# Altium project ROBOT_PCB_PROJECT.PrjPcb
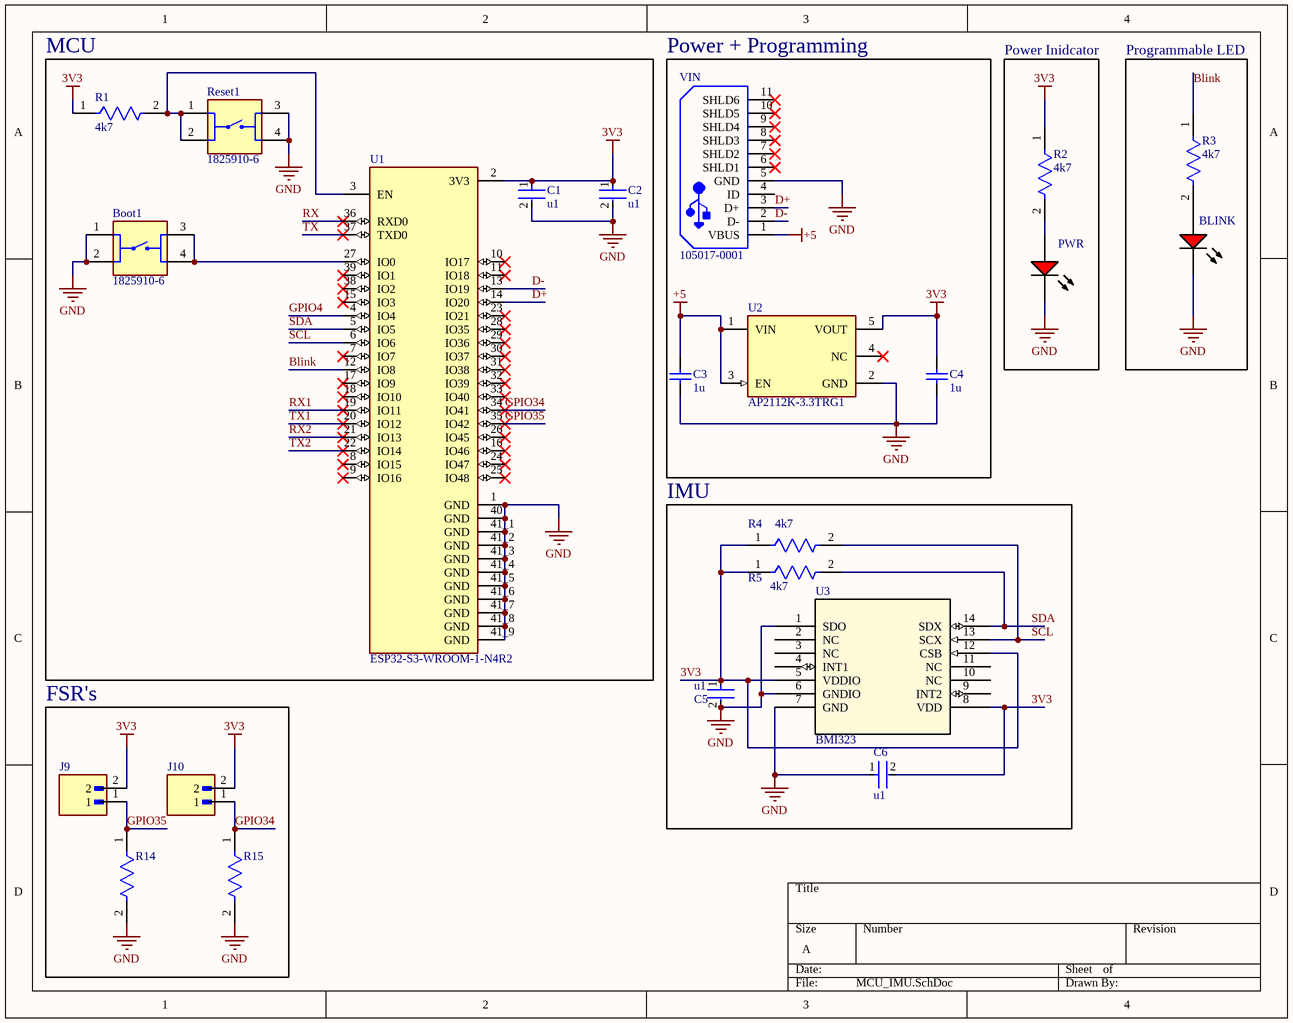
[diagram p0: MCU_IMU.SchDoc]
3 sheets, 101 parts. Net scope: global (net labels, ports and power ports of the same name join across sheets).
Board file: ROBOT_MOTHERBOARD.PcbDoc
Sheets:
  MCU_IMU.SchDoc
  UART_LOGIC.SchDoc
  Jetson_power.SchDoc

## Sheet MCU_IMU.SchDoc
size A; SheetNumber: 1; SheetTotal: 3

### Parts
BLINK  SML-LX1206IC-TR  [LUMX-SML-LX1206IC_V]  (value not drawn)
Boot1  1825910-6  [SW_1825910-6-4]
C1  u1  [FP-CC0805-0_85-MFG]
C2  u1  [FP-CC0805-0_85-MFG]
C3  1u  [CAPC2013X140X50ML20T25]
C4  1u  [CAPC2013X140X50ML20T25]
C5  u1  [FP-CC0805-0_85-MFG]
C6  u1  [FP-CC0805-0_85-MFG]
J9  M20-9990246  [HARWIN_M20-9990246]  (value not drawn)
J10  M20-9990246  [HARWIN_M20-9990246]  (value not drawn)
PWR  SML-LX1206IC-TR  [LUMX-SML-LX1206IC_V]  (value not drawn)
R1  4k7  [FP-CRCW0805-e3-IPC_B]
R2  4k7  [FP-CRCW0805-e3-IPC_B]
R3  4k7  [FP-CRCW0805-e3-IPC_B]
R4  4k7  [FP-CRCW0805-e3-IPC_B]
R5  4k7  [FP-CRCW0805-e3-IPC_B]
R14  RMCF1206FG10K0  [FP-RMCF1206-MFG]  (value not drawn)
R15  RMCF1206FG10K0  [FP-RMCF1206-MFG]  (value not drawn)
Reset1  1825910-6  [SW_1825910-6-4]
U1  ESP32-S3-WROOM-1-N4R2  [XCVR_ESP32-S3-WROOM-1-N4R2]
U2  AP2112K-3.3TRG1  [FP-SOT25-IPC_A]
U3  BMI323  [BMI323_BOS]
VIN  105017-0001  [USB-MICRO-B_V]

### Blocks framed on the sheet
MCU: Boot1 C1 C2 R1 Reset1 U1
Power + Programming: C3 C4 U2 VIN
Power Inidcator: PWR R2
Programmable LED: BLINK R3
IMU: C5 C6 R4 R5 U3
FSR's: J9 J10 R14 R15

### Nets
3V3: C1.1 C2.1 C4.2 C5.1 C6.2 J9.2 J10.2 R1.1 R2.1 R4.1 R5.1 U1.2(3V3) U2.5(VOUT) U3.5(VDDIO) U3.8(VDD) U3.12(CSB)
+5: C3.2 U2.1(VIN) U2.3(EN) VIN.1(VBUS)
GND: BLINK.2(K) Boot1.1 Boot1.2 C1.2 C2.2 C3.1 C4.1 C5.2 C6.1 PWR.2(K) R14.2 R15.2 Reset1.3 Reset1.4 U1.1(GND) U1.40(GND) U1.41_1(GND) U1.41_2(GND) U1.41_3(GND) U1.41_4(GND) U1.41_5(GND) U1.41_6(GND) U1.41_7(GND) U1.41_8(GND) U1.41_9(GND) U2.2(GND) U3.1(SDO) U3.6(GNDIO) U3.7(GND) VIN.5(GND)
Blink: R3.1 U1.12(IO8)
D+: U1.14(IO20) VIN.3(D+)
D-: U1.13(IO19) VIN.2(D-)
GPIO4: U1.4(IO4)
GPIO34: J10.1 R15.1 U1.34(IO41)
GPIO35: J9.1 R14.1 U1.35(IO42)
RX: U1.36(RXD0)
RX1: U1.19(IO11)
RX2: U1.21(IO13)
SCL: R4.2 U1.6(IO6) U3.13(SCX)
SDA: R5.2 U1.5(IO5) U3.14(SDX)
TX: U1.37(TXD0)
TX1: U1.20(IO12)
TX2: U1.22(IO14)
NetBLINK_1: BLINK.1(A) R3.2
NetBoot1_3: Boot1.3 Boot1.4 U1.27(IO0)
NetPWR_1: PWR.1(A) R2.2
NetR1_2: R1.2 Reset1.1 Reset1.2 U1.3(EN)

Not connected (* = marked no-connect by the designer): U1 7(IO7)* 8(IO15)* 9(IO16)* 10(IO17)* 11(IO18)* 15(IO3)* 16(IO46)* 17(IO9)* 18(IO10)* 23(IO21)* 24(IO47)* 25(IO48)* 26(IO45)* 28(IO35)* 29(IO36)* 30(IO37)* 31(IO38)* 32(IO39)* 33(IO40)* 38(IO2)* 39(IO1)*; U2 4(NC)*; U3 2(NC) 3(NC) 4(INT1) 9(INT2) 10(NC) 11(NC); VIN 4(ID) 6(SHLD1)* 7(SHLD2)* 8(SHLD3)* 9(SHLD4)* 10(SHLD5)* 11(SHLD6)*

### Library data of the parts
BLINK PWR = CMP-2000-07123-1: LED Red, 65 mW, -40 to 85 degC, 2-Pin SMD, RoHS, Tape and Reel; Manufacturer: Lumex; LED Material: GaAsP; Peak Wavelength: 635nm; Number of LEDs: 1; Viewing Angle: 160; Reverse Voltage: 5(Min)V; Lens Appearance: ColorlessNonDiffused; Intensity: 6mcd; Pin_Count: 2; Lens Dimensions: 2x1.6x0.5mm; Mounting: SurfaceMount; ECCN: EAR99; RoHS: Unknown; Package Description: 2-Pin Surface Mount Device, Body 3.2 x 1.5 mm; Mounting Technology: SurfaceMount; Dominant Wavelength: N/A; Supplier_Package: SMD; Supplier Standard Pack: 3,000; Color: Red; Dimension: 3.2x1.6x1.1mm; HTS: 8541402000; Part No: SML-LX1206IC-TR; Family: SML-LX1206IC; Supplier: Lumex; Datasheet URL: http://www.lumex.com/content/files/ProductAttachment/SML-LX1206IC-TR.pdf; Package Reference: SML-LX1206IC; Manufacturer URL: http://www.lumexinstruments.com/; Type: Uni-Color; Operating Temperature: -25to85C; Packaging: TapeandReel; Datasheet Version: Rev. J, 08/2012
Boot1 Reset1 = 1825910-6: Switch Push Button OFF (ON) SPST Round Button 0.05A 24VDC Momentary Contact PC Pins Thru-Hole; MF: TE Connectivity; Value: *; MP: 1825910-6; Package: None; Check_prices: https://www.snapeda.com/parts/1825910-6/TE+Connectivity+ALCOSWITCH+Switches/view-part/?ref=eda; SnapEDA_Link: https://www.snapeda.com/parts/1825910-6/TE+Connectivity+ALCOSWITCH+Switches/view-part/?ref=snap; Digi-Key_Part_Number: 450-1650-ND; Purchase-URL: https://pricing.snapeda.com/search/part/1825910-6/?ref=eda
C1 C2 C5 C6 = CMP-2100-03606-3: CC0805KRX7R9BB104 CAP CER 0.1UF 50V X7R 0805; Manufacturer: Yageo; Tolerance: 0.1; Capacitance: 100 nF; Value: 100 nF; Material: Ceramic; Device Class L1: Passive Components; ComponentLink2Description: Datasheet; Package: CC0805-0.85; Manufacturer Part Number: CC0805KRX7R9BB104; Digikey Description: CAP CER 0.1UF 50V X7R 0805; Device Class L3: Ceramic Capacitors; Temperature: -30°C to +85°C; Temperature Characteristic: X7R; Voltage Rating: 50 V; Height: 0.95mm; RoHS: TRUE; Ipc Land Pattern Name: CAPC200125X85; Device Class L2: Capacitors; Category: Cap; Temperature Range Low: -30°C; Temperature Range High: +85°C; Mouser Description: Multilayer Ceramic Capacitors MLCC - SMD/SMT 100nF 50V X7R 10%; Footprint Url: http://www.yageo.com/exep/pages/download/literatures/UPY-C_GEN_24.pdf; Automotive: No; Octopart: https://octopart.com/cc0805krx7r9bb104-yageo-192993; Lead Free: Yes; ComponentLink2URL: http://www.yageo.com/documents/recent/UPY-GPHC_Y5V_6.3V-to-50V_8.pdf
C3 C4 = CMP-2007-03236-1: Manufacturer: Kemet; Part Number: C0805C105K5RACTU
J9 J10 = CMP-002-00071-1: 2.54mm (0.1) Pitch SIL Vertical Throughboard Pin Header, 6.1mm mating pin height, tin, 2 contacts; MF: Harwin; SnapEDA_Link: https://www.snapeda.com/parts/M20-9990246/Harwin/view-part/?ref=snap; Pins: 2; Check_prices: https://www.snapeda.com/parts/M20-9990246/Harwin/view-part/?ref=eda; Component Type: Standard; Design Item ID: M20-9990246; Case/Package: None; Source: M20-9990246.SchLib; Value: *; MP: M20-9990246
R1-R5 = CMP-2100-03615-2: CRCW08054K70FKEARES Thick Film, 4.7kΩ, 1%, 0.125W, 100ppm/°C, 0805; Max Power Dissipation: 125mW; Resistance: 4.7kR; Voltage Rating: 150V; Termination: SMD/SMT; Weight: 0.000194oz; Case/Package: 0805; Number of Terminations: 2; Min Operating Temperature: -55°C; Case Code (Metric): 2012; Package Quantity: 10; Depth: 1.25mm; Military Standard: Not; Composition: Thick Film; Radiation Hardening: No; Contact Plating: Tin; Height: 0.45mm; Power Rating: 125mW; Features: Automotive AEC-Q200; Tolerance: 1%; Packaging: Tape and Reel; Max Operating Temperature: 155°C; Length: 2mm; Case Code (Imperial): 0805; Voltage Rating (DC): 150V; Width: 1.25mm; Temperature Coefficient: 100ppm/°C; Lead Free: Lead Free
R14 R15 = CMP-26527-002036-1: 10kΩ ±1% 0.25W 1206 Thick Film Chip Resistor AEC-Q200 compliant; Max Power Dissipation: 250mW; Resistance: 10kR; Temperature Coefficient: 100ppm/°C; Construction: Rectangular; Contact Plating: Tin; Max Operating Temperature: 155°C; Features: Automotive AEC-Q200; Radiation Hardening: No; Military Standard: Not; RoHS Compliant: Yes; Length: 0.126inch; Number of Terminations: 2; Mount: Surface Mount; Case Code (Imperial): 1206; Case Code (Metric): 3216; Series: RMCF; Width: 0.063inch; Min Operating Temperature: -55°C; Height: 0.028inch; Resistor Type: Thick Film; Packaging: Tape and Reel; Tolerance: 1%; Depth: 1.6mm; Case/Package: 1206
U1 = ESP32-S3-WROOM-1-N4R2: Bluetooth, WiFi 802.11b/g/n, Bluetooth v5.0 Transceiver Module 2.4GHz PCB Trace Surface Mount; MF: Espressif Systems; Package: None; Purchase-URL: https://pricing.snapeda.com/search/part/ESP32-S3-WROOM-1-N4R2/?ref=eda; Price: None; Availability: In Stock; Check_prices: https://www.snapeda.com/parts/ESP32-S3-WROOM-1-N4R2/Espressif+Systems/view-part/?ref=eda; MP: ESP32-S3-WROOM-1-N4R2; SnapEDA_Link: https://www.snapeda.com/parts/ESP32-S3-WROOM-1-N4R2/Espressif+Systems/view-part/?ref=snap; Value: *
U2 = CMP-12756-000035-1: IC REG LINEAR 3.3V 600MA SOT25; Number of Regulators: 1; Output Type: Fixed; Polarity: Positive; Min Input Voltage: 2.5V; Max Input Voltage: 6V; Accuracy: 1.5%; Quiescent Current: 55uA; Dropout Voltage: 250mV; Min Operating Temperature: -40°C; Length: 3.1mm; Output Current: 600mA; Max Operating Temperature: 85°C; Package Quantity: 1; Output Voltage: 3.3V; Width: 1.7mm; Number of Outputs: 1; Packaging: Tape and Reel; Height: 1.3mm; Lead Free: Lead Free; Max Output Current: 600mA; Case/Package: SOT-23-5; Mount: Surface Mount; Number of Pins: 5
U3 = BMI323: No Description Available; Manufacturer_Name: Bosch Sensortec; Copyright: Copyright (C) 2025 Ultra Librarian. All rights reserved.; Manufacturer_Part_Number: BMI323; RefDes: RefDes; Type: Type
VIN = CMP-2000-05827-1: Micro-USB B Receptacle, Right Angle, Bottom Mount, Surface Mount, with Solder Tabs, -30 to 85 degC, 5-Pin USB, RoHS, Tape and Reel; Manufacturer: Molex; Featured Product: Micro-USBConnectorsUSBConnectors; Other Names: WM1399DKR; Package Version: Rev. F, 12/2012; Number of Contacts: 5; Connector Type: USB-microB; Catalog Drawings: 1050170001; 3D Model: 105017-0001.stp; Mating Products: WM17145-ND-CABLEMICROUSBBTOSTDA1.0MWM17147-ND-CABLEMICROUSBBTOSTDA2.0MWM17146-ND-CABLEMICROUSBBTOSTDA1.5M; PCN Assembly/Origin: ResinSupplier21/Oct/2015; Voltage - Max: 30V; Online Catalog: Molex-MicroUSB; Manufacturer URL: http://www.molex.com/; Package Description: 5-Leads USB, Micro B, Body 7.5 x 5 mm, Pitch 0.65 mm; Datasheet URL: http://www.molex.com/elqNow/elqRedir.htm?ref=http://www.molex.com/webdocs/datasheets/pdf/en-us/1050170001_IO_CONNECTORS.pdf; Ingress Protection: -; Datasheet Version: 03/2016; Mounting Type: BoardCutout,SurfaceMount,RightAngle; Circuits: 5; Standard Package: 1; Package Reference: MICRO-B; Package URL: http://www.molex.com/pdm_docs/sd/1050170001_sd.pdf; Category: Connectors,Interconnects; Series: -; RoHS Information: 1050170001CertofCompliance; Features: Shielded,SolderRetention; Family: USB,DVI,HDMIConnectors; Specifications: -; Gender: Receptacle; Packaging: Digi-Reel®; Mounting Technology: SurfaceMount

## Sheet UART_LOGIC.SchDoc
size A; SheetNumber: 2; SheetTotal: 3
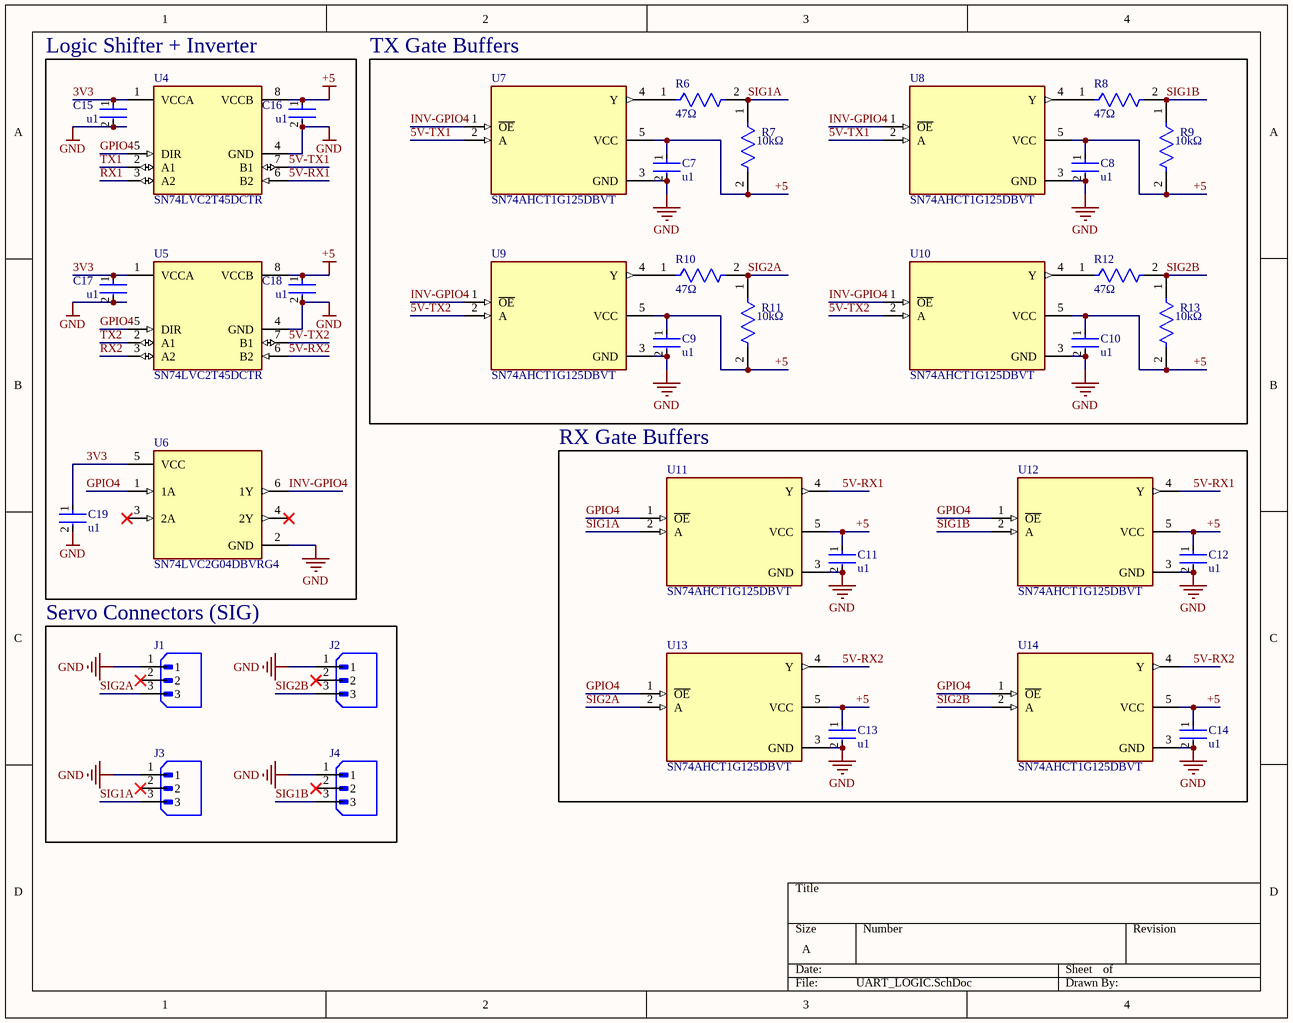
[diagram p1: UART_LOGIC.SchDoc]

### Parts
C7  u1  [FP-CC0805-0_85-MFG]
C8  u1  [FP-CC0805-0_85-MFG]
C9  u1  [FP-CC0805-0_85-MFG]
C10  u1  [FP-CC0805-0_85-MFG]
C11  u1  [FP-CC0805-0_85-MFG]
C12  u1  [FP-CC0805-0_85-MFG]
C13  u1  [FP-CC0805-0_85-MFG]
C14  u1  [FP-CC0805-0_85-MFG]
C15  u1  [FP-CC0805-0_85-MFG]
C16  u1  [FP-CC0805-0_85-MFG]
C17  u1  [FP-CC0805-0_85-MFG]
C18  u1  [FP-CC0805-0_85-MFG]
C19  u1  [FP-CC0805-0_85-MFG]
J1  B3B-XH-A  [JST_B3B-XH-A]  (value not drawn)
J2  B3B-XH-A  [JST_B3B-XH-A]  (value not drawn)
J3  B3B-XH-A  [JST_B3B-XH-A]  (value not drawn)
J4  B3B-XH-A  [JST_B3B-XH-A]  (value not drawn)
R6  47Ω  [FP-RMCF0603-IPC_A]
R7  10kΩ  [FP-RMCF1206-MFG]
R8  47Ω  [FP-RMCF0603-IPC_A]
R9  10kΩ  [FP-RMCF1206-MFG]
R10  47Ω  [FP-RMCF0603-IPC_A]
R11  10kΩ  [FP-RMCF1206-MFG]
R12  47Ω  [FP-RMCF0603-IPC_A]
R13  10kΩ  [FP-RMCF1206-MFG]
U4  SN74LVC2T45DCTR  [FP-DCT0008A-IPC_C]
U5  SN74LVC2T45DCTR  [FP-DCT0008A-IPC_C]
U6  SN74LVC2G04DBVRG4  [FP-DBV0006A-MFG]
U7  SN74AHCT1G125DBVT  [SOT95P280X145-5N]
U8  SN74AHCT1G125DBVT  [SOT95P280X145-5N]
U9  SN74AHCT1G125DBVT  [SOT95P280X145-5N]
U10  SN74AHCT1G125DBVT  [SOT95P280X145-5N]
U11  SN74AHCT1G125DBVT  [SOT95P280X145-5N]
U12  SN74AHCT1G125DBVT  [SOT95P280X145-5N]
U13  SN74AHCT1G125DBVT  [SOT95P280X145-5N]
U14  SN74AHCT1G125DBVT  [SOT95P280X145-5N]

### Blocks framed on the sheet
Logic Shifter + Inverter: C15-C19 U4-U6
TX Gate Buffers: C7-C10 R6-R13 U7-U10
RX Gate Buffers: C11-C14 U11-U14
Servo Connectors (SIG): J1-J4

### Nets
3V3: C15.1 C17.1 C19.1 U4.1(VCCA) U5.1(VCCA) U6.5(VCC)
+5: C7.1 C8.1 C9.1 C10.1 C11.1 C12.1 C13.1 C14.1 C16.1 C18.1 R7.2 R9.2 R11.2 R13.2 U4.8(VCCB) U5.8(VCCB) U7.5(VCC) U8.5(VCC) U9.5(VCC) U10.5(VCC) U11.5(VCC) U12.5(VCC) U13.5(VCC) U14.5(VCC)
GND: C7.2 C8.2 C9.2 C10.2 C11.2 C12.2 C13.2 C14.2 C15.2 C16.2 C17.2 C18.2 C19.2 J1.1 J2.1 J3.1 J4.1 U4.4(GND) U5.4(GND) U6.2(GND) U7.3(GND) U8.3(GND) U9.3(GND) U10.3(GND) U11.3(GND) U12.3(GND) U13.3(GND) U14.3(GND)
5V-RX1: U4.6(B2) U11.4(Y) U12.4(Y)
5V-RX2: U5.6(B2) U13.4(Y) U14.4(Y)
5V-TX1: U4.7(B1) U7.2(A) U8.2(A)
5V-TX2: U5.7(B1) U9.2(A) U10.2(A)
GPIO4: U4.5(DIR) U5.5(DIR) U6.1(1A) U11.1(~{OE}) U12.1(~{OE}) U13.1(~{OE}) U14.1(~{OE})
INV-GPIO4: U6.6(1Y) U7.1(~{OE}) U8.1(~{OE}) U9.1(~{OE}) U10.1(~{OE})
RX1: U4.3(A2)
RX2: U5.3(A2)
SIG1A: J3.3 R6.2 R7.1 U11.2(A)
SIG1B: J4.3 R8.2 R9.1 U12.2(A)
SIG2A: J1.3 R10.2 R11.1 U13.2(A)
SIG2B: J2.3 R12.2 R13.1 U14.2(A)
TX1: U4.2(A1)
TX2: U5.2(A1)
NetR6_1: R6.1 U7.4(Y)
NetR8_1: R8.1 U8.4(Y)
NetR10_1: R10.1 U9.4(Y)
NetR12_1: R12.1 U10.4(Y)

Not connected (* = marked no-connect by the designer): J1 2*; J2 2*; J3 2*; J4 2*; U6 3(2A)* 4(2Y)*

### Library data of the parts
C7-C19 = CMP-2100-03606-3: as C1 on sheet MCU_IMU; Device Class L1: Passive Components; ComponentLink2Description: Datasheet; Package: CC0805-0.85; Manufacturer Part Number: CC0805KRX7R9BB104; Digikey Description: CAP CER 0.1UF 50V X7R 0805; Device Class L3: Ceramic Capacitors; Temperature: -30°C to +85°C; Temperature Characteristic: X7R; Voltage Rating: 50 V; Height: 0.95mm; RoHS: TRUE; Ipc Land Pattern Name: CAPC200125X85; Device Class L2: Capacitors; Category: Cap; Temperature Range Low: -30°C; Temperature Range High: +85°C; Mouser Description: Multilayer Ceramic Capacitors MLCC - SMD/SMT 100nF 50V X7R 10%; Footprint Url: http://www.yageo.com/exep/pages/download/literatures/UPY-C_GEN_24.pdf; Automotive: No; Octopart: https://octopart.com/cc0805krx7r9bb104-yageo-192993; Lead Free: Yes; ComponentLink2URL: http://www.yageo.com/documents/recent/UPY-GPHC_Y5V_6.3V-to-50V_8.pdf
J1-J4 = CMP-002-00071-1: Connector Header Through Hole 3 position 0.098 (2.50mm); MF: JST Sales; Case/Package: None; Pins: 3; SnapEDA_Link: https://www.snapeda.com/parts/B3B-XH-A/JST+Sales+America+Inc./view-part/?ref=snap; MP: B3B-XH-A; Component Type: Standard; Check_prices: https://www.snapeda.com/parts/B3B-XH-A/JST+Sales+America+Inc./view-part/?ref=eda; Source: B3B-XH-A.SchLib; Value: *; Design Item ID: B3B-XH-A
R6 R8 R10 R12 = CMP-26527-000678-1: 47Ω ±1% 0.1W 0603 Thick Film Chip Resistor AEC-Q200 compliant RMCF0603FG47R0; Power Rating: 100mW; Resistance: 47R; Case/Package: 0603; RoHS Compliant: Yes
R7 R9 R11 R13 = CMP-26527-002036-1: 10kΩ ±1% 0.25W 1206 Thick Film Chip Resistor AEC-Q200 compliant RMCF1206FG10K0; Max Power Dissipation: 250mW; Resistance: 10kR; Temperature Coefficient: 100ppm/°C; Construction: Rectangular; Contact Plating: Tin; Max Operating Temperature: 155°C; Features: Automotive AEC-Q200; Radiation Hardening: No; Military Standard: Not; RoHS Compliant: Yes; Length: 0.126inch; Number of Terminations: 2; Mount: Surface Mount; Case Code (Imperial): 1206; Case Code (Metric): 3216; Series: RMCF; Width: 0.063inch; Min Operating Temperature: -55°C; Height: 0.028inch; Resistor Type: Thick Film; Packaging: Tape and Reel; Tolerance: 1%; Depth: 1.6mm; Case/Package: 1206
U4 U5 = CMP-0000-1: 2-Bit Dual Supply Transceiver with Configurable Voltage-Level Shifting and 3-State Outputs 8-SSOP -40 to 85; Manufacturer Lifecycle Status: ACTIVE; High Level Output Current: -32mA; Low Level Output Current: 32mA; Min Supply Voltage: 1.65V; Max Junction Temperature (Tj): 150°C; Polarity: Non-Inverting; Max Supply Voltage: 5.5V; Turn-On Delay Time: 17.7ns; Number of Channels: 2; Quiescent Current: 3µA; Number of Circuits: 1; Direction: Bidirectional; Data Rate: 420Mbps; Logic Function: Transceiver, Translator; Output Current: 50mA; Propagation Delay: 45.2ns; Packaging: Cut Tape; Contact Plating: Gold; Min Operating Temperature: -40°C; Ambient Temperature Range High: 85°C; Max Operating Temperature: 85°C; Height: 1.3mm; Width: 2.8mm; RoHS: Compliant; REACH SVHC: No; Length: 2.95mm; Weight: 23.388357mg; Lifecycle Status: Production; Schedule B: 8542390000, 8542390000; Pins: 8; Lead Free: Lead Free; Number of Bits: 2; Radiation Hardening: No; Number of Inputs: 1; Number of Elements: 1; Number of Outputs: 1; Thickness: 1.29mm; Case/Package: SSOP
U6 = CMP-04903-000086-1: IC INVERTER 2CH 2-INP SOT23-6; Quiescent Current: 10uA; Number of Elements: 2; Propagation Delay: 3.7ns; Min Supply Voltage: 1.65V; High Level Output Current: -32mA; Max Supply Voltage: 5.5V; Low Level Output Current: 32mA; Operating Supply Voltage: 5V; Turn-On Delay Time: 8ns; Mount: Surface Mount; Min Operating Temperature: -40°C; Logic Function: Inverter; Lead Free: Lead Free; Number of Bits: 2; Number of Pins: 6; Radiation Hardening: No; Max Operating Temperature: 125°C; Number of Circuits: 2; Weight: 0.000557oz; Number of Inputs: 2; RoHS Compliant: Yes; Technology: CMOS; Packaging: Tape and Reel; Number of Gates: 2; Case/Package: SOT-23-6; Package Quantity: 3000; Series: 74LVC
U7-U14 = CMP-009-000000-3: Single 4.5-V to 5.5-V buffer with TTL-compatible CMOS inputs and 3-state outputs; MF: Texas Instruments; Pin Count: 5; Design Item ID: SN74AHCT1G125DBVT; Value: *; Source: SN74AHCT1G125DBVT.SchLib; Check_prices: https://www.snapeda.com/parts/SN74AHCT1G125DBVT/Texas+Instruments/view-part/?ref=eda; Package: SOT-23-5 Texas Instruments; MP: SN74AHCT1G125DBVT; Component Type: Standard; SnapEDA_Link: https://www.snapeda.com/parts/SN74AHCT1G125DBVT/Texas+Instruments/view-part/?ref=snap

## Sheet Jetson_power.SchDoc
size A; SheetNumber: 3; SheetTotal: 3
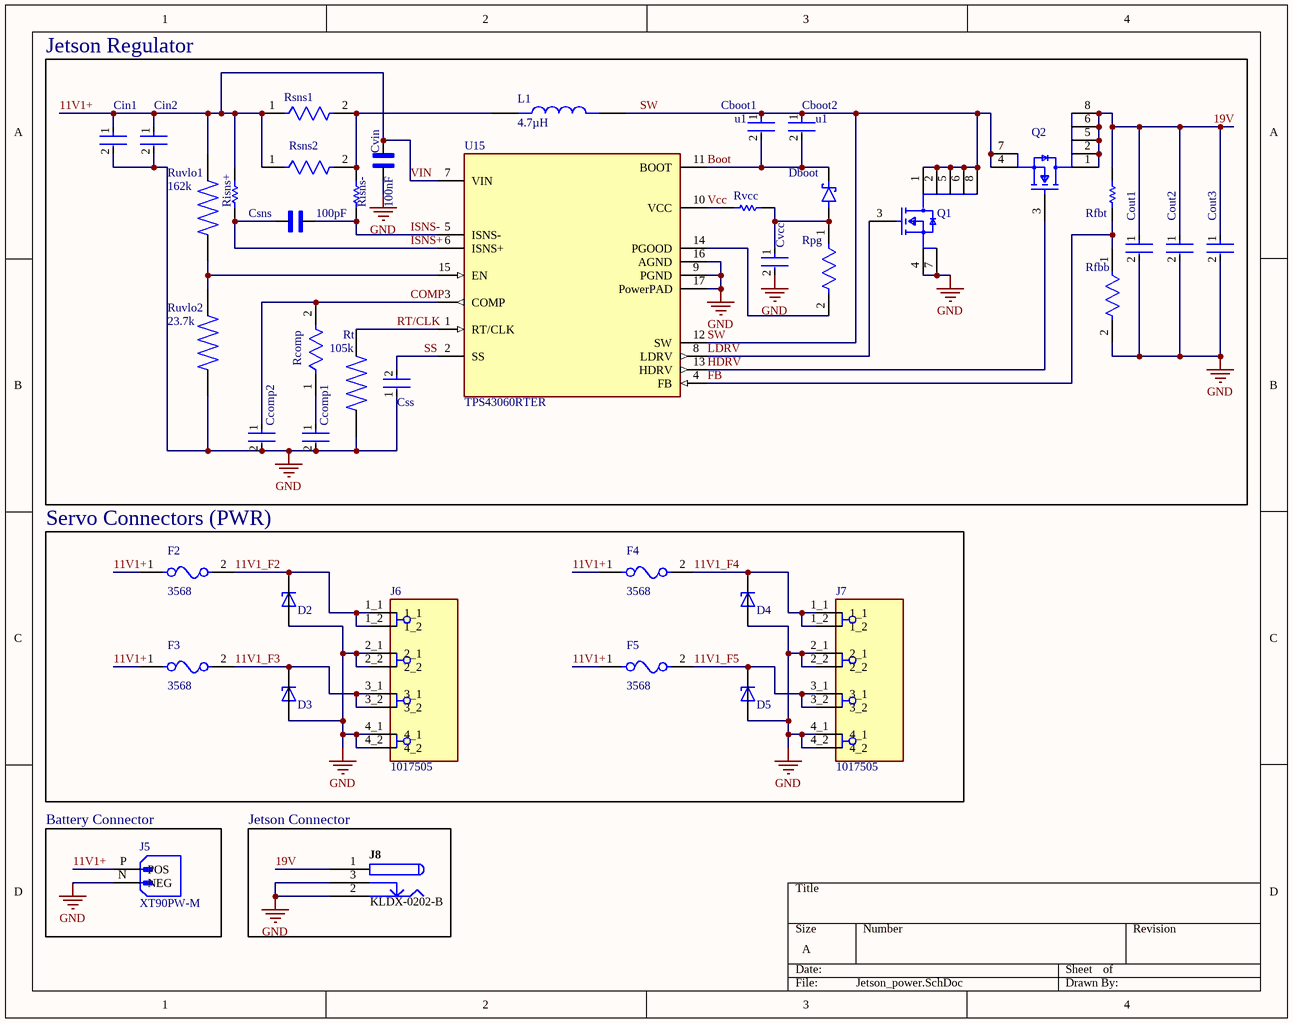
[diagram p2: Jetson_power.SchDoc]

### Parts
Cboot1  u1  [FP-CC0805-0_85-MFG]
Cboot2  u1  [FP-CC0805-0_85-MFG]
Ccomp1  CGA4C2C0G1H822J060AA  [FP-CGA4J-IPC_A]  (value not drawn)
Ccomp2  GRM1555C1H391JA01J  [FP-GRM155-0_05-IPC_A]  (value not drawn)
Cin1  CL32A106KBJNNNE  [FP-CL32-IPC_B]  (value not drawn)
Cin2  CL32A106KBJNNNE  [FP-CL32-IPC_B]  (value not drawn)
Cout1  CL32B106KBJNNWE  [FP-CL32-IPC_B]  (value not drawn)
Cout2  CL32B106KBJNNWE  [FP-CL32-IPC_B]  (value not drawn)
Cout3  CL32B106KBJNNWE  [FP-CL32-IPC_B]  (value not drawn)
Csns  value 100pF  [CAPC1608X90N]  (hidden comment: GRM1885C1H101JA01D)
Css  C1608C0G1E472J080AA  [FP-C1608-080-0_1-IPC_A]  (value not drawn)
Cvcc  GRM188R61C106MA73D  [FP-GRM188-0_2-IPC_A]  (value not drawn)
Cvin  value 100nF  [CAPC1005X55N]  (hidden comment: GRM155R71C104KA88D)
D2  SMBJ13A-13-F  [DIOM5336X250N]  (value not drawn)
D3  SMBJ13A-13-F  [DIOM5336X250N]  (value not drawn)
D4  SMBJ13A-13-F  [DIOM5336X250N]  (value not drawn)
D5  SMBJ13A-13-F  [DIOM5336X250N]  (value not drawn)
Dboot  XBS053V15R-G  [DIO_XBS053V15R-G]  (value not drawn)
F2  3568  [FP-3568-MFG]
F3  3568  [FP-3568-MFG]
F4  3568  [FP-3568-MFG]
F5  3568  [FP-3568-MFG]
J5  XT90PW-M  [AMASS_XT90PW-M - duplicate]
J6  1017505  [PHOENIX_1017505]
J7  1017505  [PHOENIX_1017505]
J8  KLDX-0202-B  [KYCN-KLDX-0202-B_V]
L1  value 4.7µH  [IND_XAL6060-472MEB]  (hidden comment: XAL6060-472MEB)
Q1  CSD17571Q2  [FP-DQK0006C-MFG]  (value not drawn)
Q2  CSD17571Q2  [FP-DQK0006C-MFG]  (value not drawn)
Rcomp  CRCW04025K36FKED  [FP-CRCW0402-e3-IPC_B]  (value not drawn)
Rfbb  CRCW040211K0FKED  [FP-CRCW0402-e3-IPC_A]  (value not drawn)
Rfbt  160K 1% 0603(1608)  [RESC0603(1608)_N]  (value not drawn)
Risns+  CRCW040210R0FKED  [RESC1005X40X25NL05T05]  (value not drawn)
Risns-  CRCW040210R0FKED  [RESC1005X40X25NL05T05]  (value not drawn)
Rpg  CRCW0402100KFKED  [FP-CRCW0402-e3-IPC_C]  (value not drawn)
Rsns1  PRL1632-R010-F-T1  [FP-PRL1632-MFG]  (value not drawn)
Rsns2  PRL1632-R010-F-T1  [FP-PRL1632-MFG]  (value not drawn)
Rt  value 105k  [RESC0603X26N]  (hidden comment: RC0201FR-07105KL)
Ruvlo1  value 162k  [RESC0603X26N]  (hidden comment: RC0201FR-07162KL)
Ruvlo2  value 23.7k  [RESC0603X26N]  (hidden comment: RC0201FR-0723K7L)
Rvcc  CRCW04022R00FKED  [RESC1005X40X25ML05T05]  (value not drawn)
U15  TPS43060RTER  [FP-RTE0016E-IPC_B]

### Blocks framed on the sheet
Jetson Regulator: Cboot1 Cboot2 Ccomp1 Ccomp2 Cin1 Cin2 Cout1-Cout3 Csns Css Cvcc Cvin Dboot L1 Q1 Q2 Rcomp Rfbb Rfbt Risns+ Risns- Rpg Rsns1 Rsns2 Rt Ruvlo1 Ruvlo2 Rvcc U15
Servo Connectors (PWR): D2-D5 F2-F5 J6 J7
Battery Connector: J5
Jetson Connector: J8

### Nets
GND: Ccomp1.2 Ccomp2.2 Cin1.2 Cin2.2 Cout1.2 Cout2.2 Cout3.2 Css.1 Cvcc.2 Cvin.1 D2.2(A) D3.2(A) D4.2(A) D5.2(A) J5.N(NEG) J6.2_1 J6.2_2 J6.4_1 J6.4_2 J7.2_1 J7.2_2 J7.4_1 J7.4_2 J8.2 J8.3 Q1.4(S) Q1.7(S) Rfbb.2 Rt.1 Ruvlo2.1 U15.9(PGND) U15.16(AGND) U15.17(PowerPAD)
11V1+: Cin1.1 Cin2.1 Cvin.2 F2.1 F3.1 F4.1 F5.1 J5.P(POS) Risns+.1 Rsns1.1 Rsns2.1 Ruvlo1.2 U15.7(VIN)  [also labelled VIN]
11V1_F2: D2.1(C) F2.2 J6.1_1 J6.1_2
11V1_F3: D3.1(C) F3.2 J6.3_1 J6.3_2
11V1_F4: D4.1(C) F4.2 J7.1_1 J7.1_2
11V1_F5: D5.1(C) F5.2 J7.3_1 J7.3_2
19V: Cout1.1 Cout2.1 Cout3.1 J8.1 Q2.1(D) Q2.2(D) Q2.5(D) Q2.6(D) Q2.8(D) Rfbt.2
Boot: Cboot1.2 Cboot2.2 Dboot.C(K) U15.11(BOOT)
COMP: Ccomp2.1 Rcomp.2 U15.3(COMP)
FB: Rfbb.1 Rfbt.1 U15.4(FB)
HDRV: Q2.3(G) U15.13(HDRV)
ISNS+: Csns.1 Risns+.2 U15.6(ISNS+)
ISNS-: Csns.2 Risns-.1 U15.5(ISNS-)
LDRV: Q1.3(G) U15.8(LDRV)
RT/CLK: Rt.2 U15.1(RT/CLK)
SS: Css.2 U15.2(SS)
SW: Cboot1.1 Cboot2.1 L1.2 Q1.1(D) Q1.2(D) Q1.5(D) Q1.6(D) Q1.8(D) Q2.4(S) Q2.7(S) U15.12(SW)
Vcc: Rvcc.1 U15.10(VCC)
NetCcomp1_1: Ccomp1.1 Rcomp.1
NetCvcc_1: Cvcc.1 Dboot.A Rpg.1 Rvcc.2
NetL1_1: L1.1 Risns-.2 Rsns1.2 Rsns2.2
NetRpg_2: Rpg.2 U15.14(PGOOD)
NetRuvlo1_1: Ruvlo1.1 Ruvlo2.2 U15.15(EN)

### Library data of the parts
Cboot1 Cboot2 = CMP-2100-03606-3: CC0805KRX7R9BB104 CAP CER 0.1UF 50V X7R 0805; Manufacturer: Yageo; Tolerance: 0.1; Capacitance: 100 nF; Value: 100 nF; Device Class L1: Passive Components; ComponentLink2Description: Datasheet; Package: CC0805-0.85; Manufacturer Part Number: CC0805KRX7R9BB104; Digikey Description: CAP CER 0.1UF 50V X7R 0805; Device Class L3: Ceramic Capacitors; Temperature: -30°C to +85°C; Temperature Characteristic: X7R; Voltage Rating: 50 V; Height: 0.95mm; RoHS: TRUE; Ipc Land Pattern Name: CAPC200125X85; Device Class L2: Capacitors; Category: Cap; Temperature Range Low: -30°C; Temperature Range High: +85°C; Material: Ceramic; Mouser Description: Multilayer Ceramic Capacitors MLCC - SMD/SMT 100nF 50V X7R 10%; Footprint Url: http://www.yageo.com/exep/pages/download/literatures/UPY-C_GEN_24.pdf; Automotive: No; Octopart: https://octopart.com/cc0805krx7r9bb104-yageo-192993; Lead Free: Yes; ComponentLink2URL: http://www.yageo.com/documents/recent/UPY-GPHC_Y5V_6.3V-to-50V_8.pdf
Ccomp1 = CMP-08246-000542-1: Cap Ceramic 8.2nF 50V C0G 5% Pad SMD 0805 +125°C Automotive T/R; Capacitance: 8.2nF; Case/Package: 0805; Package Quantity: 1; Weight: 0.000194oz; Voltage Rating (DC): 50V; Composition: Ceramic; Min Operating Temperature: -55°C; Case Code (Metric): 2012; Length: 2mm; Packaging: Tape and Reel; Height: 0.6mm; REACH SVHC: No SVHC; Case Code (Imperial): 0805; Mount: Surface Mount; Voltage Rating: 50V; Dielectric: C0G; Max Operating Temperature: 125°C; Width: 0.049inch; Depth: 1.25mm; Tolerance: 5%; Termination: SMD/SMT; Thickness: 0.028inch; Ratings: AEC-Q200
Ccomp2 = CMP-2008-04006-2: Chip Multilayer Ceramic Capacitors for General Purpose, 0402, 390pF, C0G, 30ppm/°C, 5%, 50V; Termination: SMD/SMT; Max Operating Temperature: 125°C; Voltage: 50V; Packaging: Tape and Reel; Case Code (Imperial): 0402; Voltage Rating (DC): 50V; Case/Package: 0402; Case Code (Metric): 1005; Package Quantity: 1; Capacitance: 390pF; Length: 1mm; Depth: 0.5mm; Mount: Surface Mount; Voltage Rating: 50V; Tolerance: 5%; Min Operating Temperature: -55°C; Dielectric: C0G; Height: 0.5mm; Radiation Hardening: No; Thickness: 0.022inch; Width: 0.02inch
Cin1 Cin2 = CMP-13271-001337-1: Cap Ceramic 10uF 50V X5R ±10% SMD 1210 +85°C Embossed T/R; Dielectric: X5R; Case Code (Imperial): 1210; Mount: Surface Mount; Depth: 2.5mm; Thickness: 0.106inch; Length: 0.126inch; Voltage Rating: 50V; Min Operating Temperature: -55°C; Case/Package: 1210; Case Code (Metric): 3225; Lead Free: Lead Free; Packaging: Tape and Reel; Width: 0.098inch; Capacitance: 10uF; Voltage Rating (DC): 50V; Max Operating Temperature: 85°C; Tolerance: 10%
Cout1-Cout3 = CMP-13271-004028-1: Cap Ceramic 10uF 50V X7R ±10% SMD 1210 +125°C Embossed T/R; Dielectric: X7R; Packaging: Tape and Reel; Width: 0.098inch; Case Code (Metric): 3225; Length: 0.126inch; Mount: Surface Mount; Max Operating Temperature: 125°C; Thickness: 0.106inch; Min Operating Temperature: -55°C; Case/Package: 1210; Lead Free: Lead Free; Voltage Rating: 50V; Capacitance: 10uF; Case Code (Imperial): 1210; Package Quantity: 1; Tolerance: 10%
Csns = CMP-001-00083-1: SMD Capacitor C0G(EIA) with Capacitance: 100pF Tol. 5%. Rated Voltage: 50Vdc; MF: Murata Electronics; Source: GRM1885C1H101JA01D.SchLib; MP: GRM1885C1H101JA01D; Component Type: Standard; Pins: 2; Case/Package: 1608 Murata; Design Item ID: GRM1885C1H101JA01D; SnapEDA_Link: https://www.snapeda.com/parts/GRM1885C1H101JA01D/Murata+Electronics+North+America/view-part/?ref=snap; Check_prices: https://www.snapeda.com/parts/GRM1885C1H101JA01D/Murata+Electronics+North+America/view-part/?ref=eda
Css = CMP-08246-004785-1: Multilayer Ceramic Capacitors 4.7nF ±5% 25V C0G SMD 0603; Dielectric Material: Ceramic; RoHS Compliant: Yes; Tolerance: 5%; Thickness: 0.037inch; Voltage Rating: 25V; Number of Pins: 2; Series: C; Max Operating Temperature: 125°C; Lead Free: Lead Free; Case Code (Metric): 1608; Construction: Flat; Case/Package: 0603; Min Operating Temperature: -55°C; Mount: Surface Mount; Voltage Rating (DC): 25V; Depth: 0.8mm; Case Code (Imperial): 0603; Width: 0.031inch; Radiation Hardening: No; Package Quantity: 1; Weight: 7.1E-05oz; Length: 1.6mm; Packaging: Tape and Reel; Height: 0.8mm; Dielectric: C0G; Capacitance: 4.7nF; Termination: SMD/SMT
Cvcc = CMP-2006-02814-2: Chip Multilayer Ceramic Capacitors for General Purpose, 0603, 10uF, X5R, 15%, 20%, 16V; Width: 0.031inch; Case/Package: 0603; Mount: Surface Mount; Capacitance: 10uF; Depth: 0.8mm; REACH SVHC: No SVHC; Lead Free: Lead Free; Tolerance: 20%; Case Code (Imperial): 0603; Voltage Rating: 16V; Height: 0.8mm; Case Code (Metric): 1608; Thickness: 0.031inch; Voltage: 16V; Voltage Rating (DC): 16V; Length: 1.6mm; Max Operating Temperature: 85°C; Dielectric: X5R; Min Operating Temperature: -55°C; Packaging: Tape and Reel; Package Quantity: 4000
Cvin = CMP-001-00084-1: SMD Capacitor X7R(EIA) with Capacitance: 0.10uF Tol. 10%. Rated Voltage: 16Vdc; MF: Murata; Check_prices: https://www.snapeda.com/parts/GRM155R71C104KA88D/Murata/view-part/?ref=eda; Source: GRM155R71C104KA88D.SchLib; Design Item ID: GRM155R71C104KA88D; MP: GRM155R71C104KA88D; Case/Package: 1005-2 Murata; Pins: 2; SnapEDA_Link: https://www.snapeda.com/parts/GRM155R71C104KA88D/Murata/view-part/?ref=snap; Component Type: Standard
D2-D5 = CMP-004-00032-1: 400 W 13 V Uni-Directional SMT Transient Voltage Suppressor Diode - DO-214AA; MF: Diodes Inc.; Component Type: Standard; Value: *; Case/Package: DO-214 Diodes Inc.; SnapEDA_Link: https://www.snapeda.com/parts/SMBJ13A-13-F/Diodes+Inc./view-part/?ref=snap; Check_prices: https://www.snapeda.com/parts/SMBJ13A-13-F/Diodes+Inc./view-part/?ref=eda; Design Item ID: SMBJ13A-13-F; Pins: 2; Source: SMBJ13A-13-F.SchLib; MP: SMBJ13A-13-F
Dboot = CMP-004-00031-1: Diode Schottky 20V 500mA Surface Mount SOD-523; MF: Torex; Value: *; Pins: 2; Case/Package: SOD-523 Torex; SnapEDA_Link: https://www.snapeda.com/parts/XBS053V15R-G/Torex/view-part/808826/?ref=snap; Digi-Key_Purchase_URL: https://www.digikey.com/product-detail/en/torex-semiconductor-ltd/XBS053V15R-G/XBS053V15R-G-ND/2765022?utm_source=snapeda&utm_medium=aggregator&utm_campaign=symbol; MP: XBS053V15R-G; Design Item ID: XBS053V15R-G; Source: SnapEDAsch.SchLib; Component Type: Standard; Digi-Key_Part_Number: XBS053V15R-G-ND
F2-F5 = CMP-2000-05464-2: NexarPartId: 8116161; Approvals: UL; Body Material: Nylon; Illumination Type: Illuminated; Voltage Rating (AC): 500V; Current Rating: 20A; Number of Poles: 1; Color: Black; Material: Brass, Nylon, Tin; Depth: 6.73mm; Max Operating Temperature: 145°C; Length: 16mm; Mount: PCB, Vertical; REACH SVHC: No SVHC; Lead Free: Lead Free; Min Operating Temperature: -50°C; Flammability Rating: UL94 V-0; RoHS: Compliant; Orientation: Vertical; Fuse Current: 20A; Termination: PC Pin; Number of Circuits: 1; Contact Plating: Tin; Voltage: 500V; Contact Material: Brass
J5 = XT90PW-M: Socket; DC supply; XT90; male; PIN: 2; on PCBs; THT; Colour: yellow; MF: AMASS; SnapEDA_Link: https://www.snapeda.com/parts/XT90PW-M/AMASS/view-part/?ref=snap; Package: Package; Value: *; MP: XT90PW-M; Check_prices: https://www.snapeda.com/parts/XT90PW-M/AMASS/view-part/?ref=eda
J6 J7 = CMP-011-000000-2: MF: {'manufacturer': u'Phoenix Contact'}; Source: 1017505.SchLib; Price: None; MP: 1017505; Package: None; Component Type: Standard; Availability: Unavailable; Design Item ID: 1017505; Pin Count: 8; Value: *
J8 = CMP-0256-00001-1: 3 Conductor Power Jack, 2 break 2 aux contacts; ComponentLink2URL: http://anacapa.kycon.com/Catalog_PDF/KLDX_0202.pdf; PackageReference: KLDX-0202-B; Contact Finish: Brass; ComponentLink2Description: Datasheet; Mounting Technology: Through Hole; PackageDescription: Jack, 9 x 14.5 mm Body, 2.5 mm Center Pin Diameter; ComponentLink1Description: Manufacturer URL; PartNumber: KLDX-0202-B; ComponentLink1URL: http://kycon.com/
L1 = CMP-006-00021-1: Power inductor, shielded, 20% tol, SMT, RoHS, halogen-f; MF: Coilcraft; SnapEDA_Link: https://www.snapeda.com/parts/XAL6060-472MEB/Coilcraft/view-part/?ref=snap; Design Item ID: XAL6060-472MEB; Source: XAL6060-472MEB.SchLib; Check_prices: https://www.snapeda.com/parts/XAL6060-472MEB/Coilcraft/view-part/?ref=eda; MP: XAL6060-472MEB; Case/Package: None; Component Type: Standard; Pins: 2
Q1 Q2 = CMP-04962-000062-1: MOSFET N-CH 30V 22A 6SON; Number of Elements: 1; Rise Time: 19ns; Gate to Source Voltage (Vgs): 20V; Turn-On Delay Time: 5.3ns; Input Capacitance: 468pF; Turn-Off Delay Time: 8ns; Power Dissipation: 2.5W; Element Configuration: Single; Fall Time: 26ns; Drain to Source Resistance: 29mR; Contact Plating: Tin; Continuous Drain Current (ID): 22A; Max Operating Temperature: 150°C; Drain to Source Breakdown Voltage: 30V; Number of Channels: 1; Max Power Dissipation: 2.5W; Packaging: Tape and Reel; RoHS Compliant: Yes; Mount: Surface Mount; Lead Free: Lead Free; Min Operating Temperature: -55°C; Package Quantity: 3000; Drain to Source Voltage (Vdss): 30V; Rds On Max: 29mR; Number of Pins: 6
Rcomp = CMP-1011-00593-3: RES Thick Film, 5.36kΩ, 1%, 0.063W, 100ppm/°C, 0402; Voltage Rating: 50V; Resistance: 5.36kR; Max Power Dissipation: 63mW; Temperature Coefficient: 100ppm/°C; Series: CRCW; Number of Terminations: 2; Resistance Tolerance: 1%; Min Operating Temperature: -55°C; Weight: 2.3E-05oz; Case Code (Metric): 1005; Military Standard: Not; Depth: 0.5mm; Contact Plating: Tin; Number of Pins: 2; Length: 1mm; Max Operating Temperature: 155°C; Tolerance: 1%; Voltage Rating (DC): 50V; Case Code (Imperial): 0402; Height: 0.016inch; Packaging: Tape and Reel; Features: Automotive AEC-Q200; RoHS Compliant: Yes; Construction: Rectangular; Power Rating: 63mW; Lead Free: Lead Free; Package Quantity: 10; Radiation Hardening: No; Resistor Type: Thick Film; Case/Package: 0402; Width: 0.5mm
Rfbb = CMP-2002-08157-2: RES Thick Film, 11kΩ, 1%, 0.063W, 100ppm/°C, 0402; Power Rating: 63mW; Voltage Rating (DC): 50V; Resistance: 11kR; Case Code (Imperial): 0402; Features: Automotive AEC-Q200; Lead Free: Lead Free; Contact Plating: Tin; Weight: 2.3E-05oz; Max Power Dissipation: 63mW; Termination: SMD/SMT; Width: 0.02inch; Number of Terminations: 2; Length: 1mm; Height: 0.35mm; Radiation Hardening: No; Tolerance: 1%; Voltage Rating: 50V; Military Standard: Not; Package Quantity: 10; Depth: 0.5mm; Case Code (Metric): 1005; Temperature Coefficient: 100ppm/°C; Number of Pins: 2; Composition: Thick Film; Max Operating Temperature: 155°C; Case/Package: 0402; Packaging: Tape and Reel; Min Operating Temperature: -55°C
Rfbt = CMP-1012-00757-1: 160K 0.1W 1% 0603 (1608 Metric)  SMD; Case-EIA: 0603; Value: 160000.00 Ohm; Case-Metric: 1608; Power: 0.1 W; Tolerance: 1 %; Technology: SMT
Risns+ Risns- = CMP-2002-08143-1: Manufacturer: Vishay Dale; Part Number: CRCW040210R0FKED
Rpg = CMP-2002-08123-3: RES Thick Film, 100kΩ, 1%, 0.063W, 100ppm/°C, 0402; Power Rating: 63mW; Resistance: 100kR; Voltage Rating (DC): 50V; Lead Free: Lead Free; Height: 0.35mm; Contact Plating: Tin; Min Operating Temperature: -55°C; Package Quantity: 10000; Case/Package: 0402; Temperature Coefficient: 100ppm/°C; Number of Terminations: 2; Packaging: Tape and Reel; Max Power Dissipation: 63mW; Case Code (Metric): 1005; Mount: Surface Mount; Width: 0.02inch; Termination: SMD/SMT; Length: 1mm; Number of Pins: 2; Weight: 2.3E-05oz; Radiation Hardening: No; Tolerance: 1%; Military Standard: Not; Features: Automotive AEC-Q200; Depth: 0.5mm; Composition: Thick Film; Max Operating Temperature: 155°C; Voltage Rating: 50V; Case Code (Imperial): 0402
Rsns1 Rsns2 = CMP-2003-04764-2: 10 mOhms ±1% 1W Chip Resistor Wide 0612 (1632 Metric), Current Sense Thin Film; Temperature Coefficient: 200ppm/°C; Resistance: 10mR; Power Rating: 1W; Max Power Dissipation: 1W; Resistor Type: Thin Film; Number of Terminations: 2; Case/Package: 1206; Package Quantity: 1000; Lead Free: Lead Free; RoHS Compliant: Yes; Technology: THIN FILM; Case Code (Metric): 3216; Width: 1.6mm; Case Code (Imperial): 1206; Weight: 0.000466oz; Height: 0.5mm; Max Operating Temperature: 125°C; Tolerance: 1%; Min Operating Temperature: -55°C; Length: 3.2mm; Termination: SMD/SMT; Packaging: Cut Tape
Rt = CMP-009-00177-1: 105 kOhms Â±1% 0.05W, 1/20W Chip Resistor 0201 (0603 Metric) Moisture Resistant Thick Film; MF: Yageo; Source: RC0201FR-07105KL.SchLib; Component Type: Standard; MP: RC0201FR-07105KL; Pins: 2; Design Item ID: RC0201FR-07105KL; Check_prices: https://www.snapeda.com/parts/RC0201FR-07105KL/Yageo/view-part/?ref=eda; SnapEDA_Link: https://www.snapeda.com/parts/RC0201FR-07105KL/Yageo/view-part/?ref=snap; Case/Package: SMD-2 Yageo
Ruvlo1 = CMP-009-00179-1: 162 kOhms Â±1% 0.05W, 1/20W Chip Resistor 0201 (0603 Metric) Moisture Resistant Thick Film; MF: Yageo; SnapEDA_Link: https://www.snapeda.com/parts/RC0201FR-07162KL/Yageo/view-part/?ref=snap; Component Type: Standard; Source: RC0201FR-07162KL.SchLib; Design Item ID: RC0201FR-07162KL; MP: RC0201FR-07162KL; Check_prices: https://www.snapeda.com/parts/RC0201FR-07162KL/Yageo/view-part/?ref=eda; Case/Package: 0603 Rohm Semiconductor; Pins: 2
Ruvlo2 = CMP-009-00178-1: 23.7 kOhms Â±1% 0.05W, 1/20W Chip Resistor 0201 (0603 Metric) Moisture Resistant Thick Film; MF: Yageo; Case/Package: 0603 Rohm Semiconductor; Component Type: Standard; Design Item ID: RC0201FR-0723K7L; SnapEDA_Link: https://www.snapeda.com/parts/RC0201FR-0723K7L/Yageo/view-part/?ref=snap; Source: RC0201FR-0723K7L.SchLib; Check_prices: https://www.snapeda.com/parts/RC0201FR-0723K7L/Yageo/view-part/?ref=eda; MP: RC0201FR-0723K7L; Pins: 2
Rvcc = CMP-2002-08486-1: Manufacturer: Vishay Dale; Part Number: CRCW04022R00FKED
U15 = CMP-04918-000522-1: IC REG CTRLR BOOST 16WQFN; Synchronous Rectifier: Yes; Max Frequency: 1MHz; Number of Output Phases: 1; Output Voltage: 58V; Clock Sync: No; Duty Cycle: 95%; Output Configuration: Positive; Operating Supply Voltage: 7.5V; Max Duty Cycle: 50%; Output Current: 2A; Quiescent Current: 600uA; Package Quantity: 3000; Radiation Hardening: No; Max Operating Temperature: 150°C; Number of Pins: 16; Mount: Surface Mount; RoHS Compliant: Yes; Packaging: Tape and Reel; Number of Outputs: 1; Contact Plating: Gold; Min Operating Temperature: -40°C; Lead Free: Lead Free; Switching Frequency: 1MHz; Topology: Boost

## Nets that join several sheets
3V3: MCU_IMU (16 pins), UART_LOGIC (6 pins)
+5: MCU_IMU (C3.2 U2.1 U2.3 VIN.1), UART_LOGIC (24 pins)
GND: MCU_IMU (30 pins), UART_LOGIC (28 pins), Jetson_power (33 pins)
GPIO4: MCU_IMU (U1.4), UART_LOGIC (7 pins)
RX1: MCU_IMU (U1.19), UART_LOGIC (U4.3)
RX2: MCU_IMU (U1.21), UART_LOGIC (U5.3)
TX1: MCU_IMU (U1.20), UART_LOGIC (U4.2)
TX2: MCU_IMU (U1.22), UART_LOGIC (U5.2)